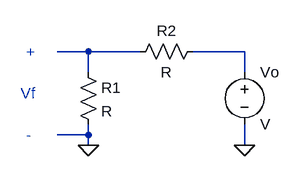
[diagram p0: schematic Realimentacao.asc]
Realimentacao.asc, the LTspice schematic file:
Version 4.1
SHEET 1 880 680
WIRE 128 176 80 176
WIRE 208 176 128 176
WIRE 368 176 288 176
WIRE 128 208 128 176
WIRE 368 208 368 176
WIRE 128 304 128 288
WIRE 128 304 80 304
WIRE 128 320 128 304
WIRE 368 320 368 288
FLAG 368 320 0
FLAG 128 320 0
SYMBOL res 112 192 R0
SYMATTR InstName R1
SYMBOL res 304 160 R90
WINDOW 0 0 56 VBottom 2
WINDOW 3 32 56 VTop 2
SYMATTR InstName R2
SYMBOL voltage 368 192 R0
SYMATTR InstName Vo
TEXT 32 176 Left 2 ;+
TEXT 24 240 Left 2 ;Vf
TEXT 32 304 Left 2 ;-

The netlist it stands for:
* Realimentacao.asc
R1 N001 0 R
R2 N002 N001 R
Vo N002 0 V
* +
* Vf
* -
.backanno
.end